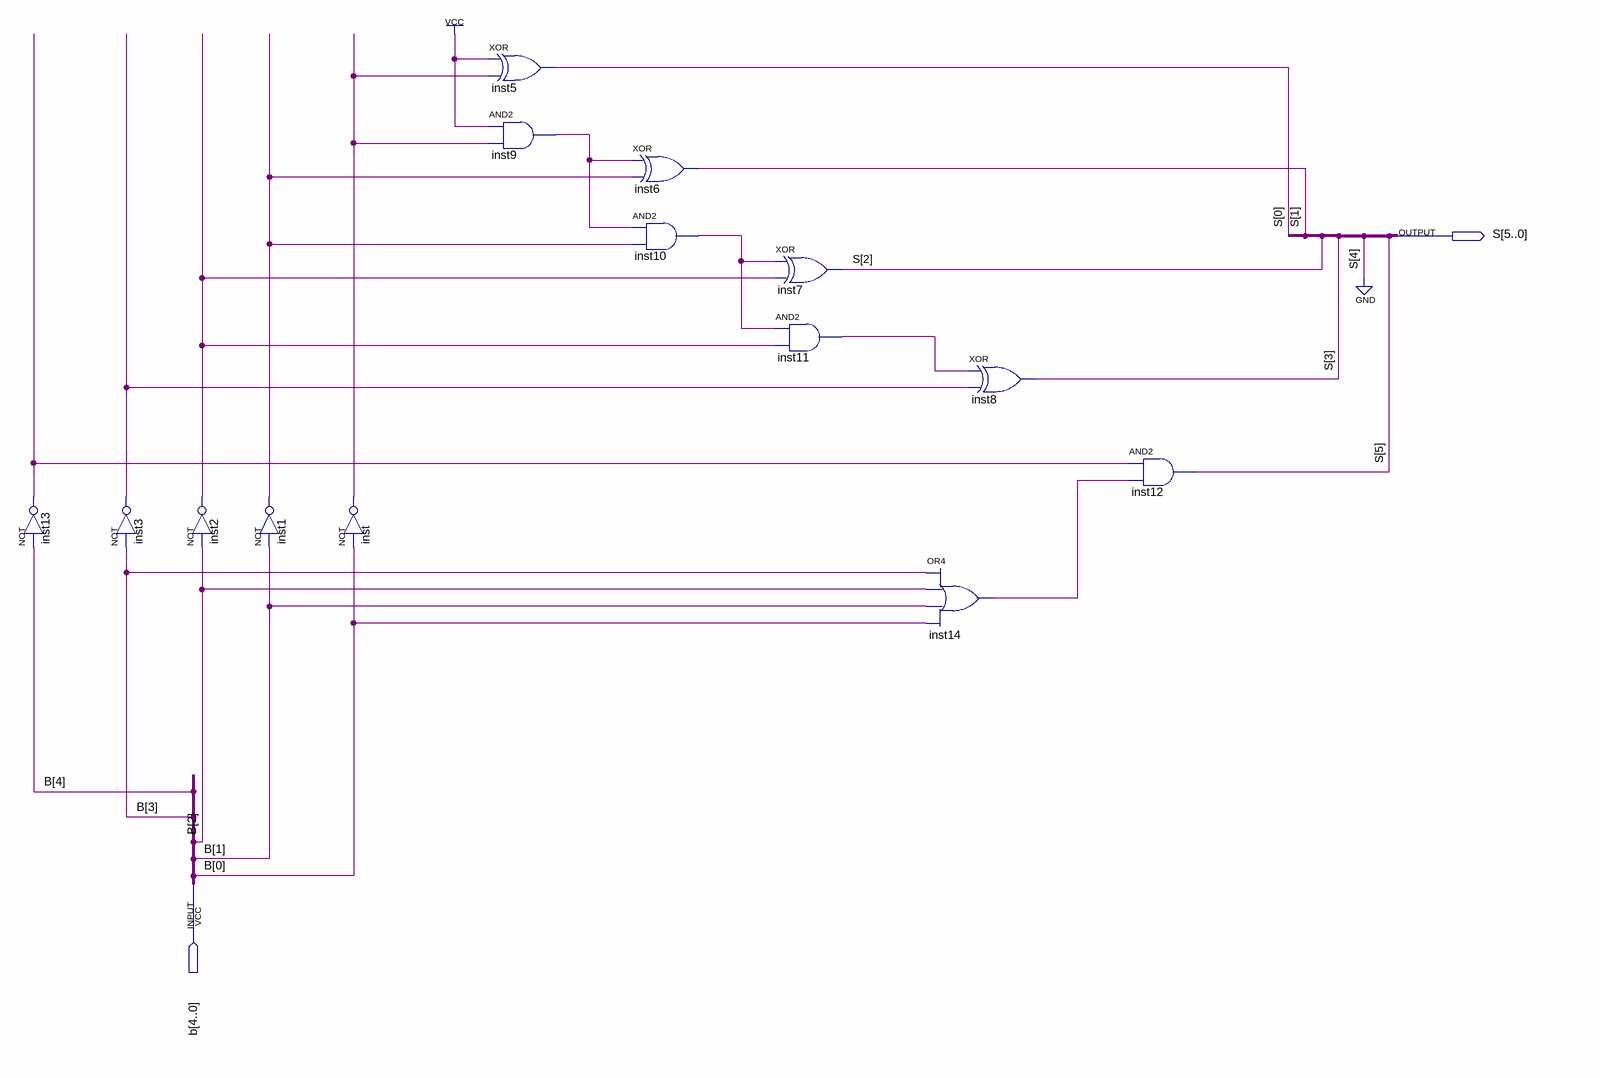
[diagram p0: schematic sheet]
// Quartus schematic complemento2.bdf as structural Verilog: 14 symbols, 2 pins
module complemento2 (
  input  [4:0] b,
  output [5:0] S
);

  wire inst1_out, inst2_out, inst3_out, inst9_out, inst10_out, inst11_out, inst13_out, inst14_out, inst_out;

  not inst13 (inst13_out, b[4]);
  not inst3 (inst3_out, b[3]);
  not inst2 (inst2_out, b[2]);
  not inst1 (inst1_out, b[1]);
  not inst (inst_out, b[0]);
  xor inst5 (S[0], 1'b1, inst_out);
  and inst9 (inst9_out, 1'b1, inst_out);
  xor inst6 (S[1], inst9_out, inst1_out);
  and inst10 (inst10_out, inst9_out, inst1_out);
  xor inst7 (S[2], inst10_out, inst2_out);
  and inst11 (inst11_out, inst10_out, inst2_out);
  or inst14 (inst14_out, b[3], b[2], b[1], b[0]);
  xor inst8 (S[3], inst11_out, inst3_out);
  and inst12 (S[5], inst13_out, inst14_out);

  assign S[4] = 1'b0;
endmodule
